# EAGLE design mainboard (EAGLE 5.11)
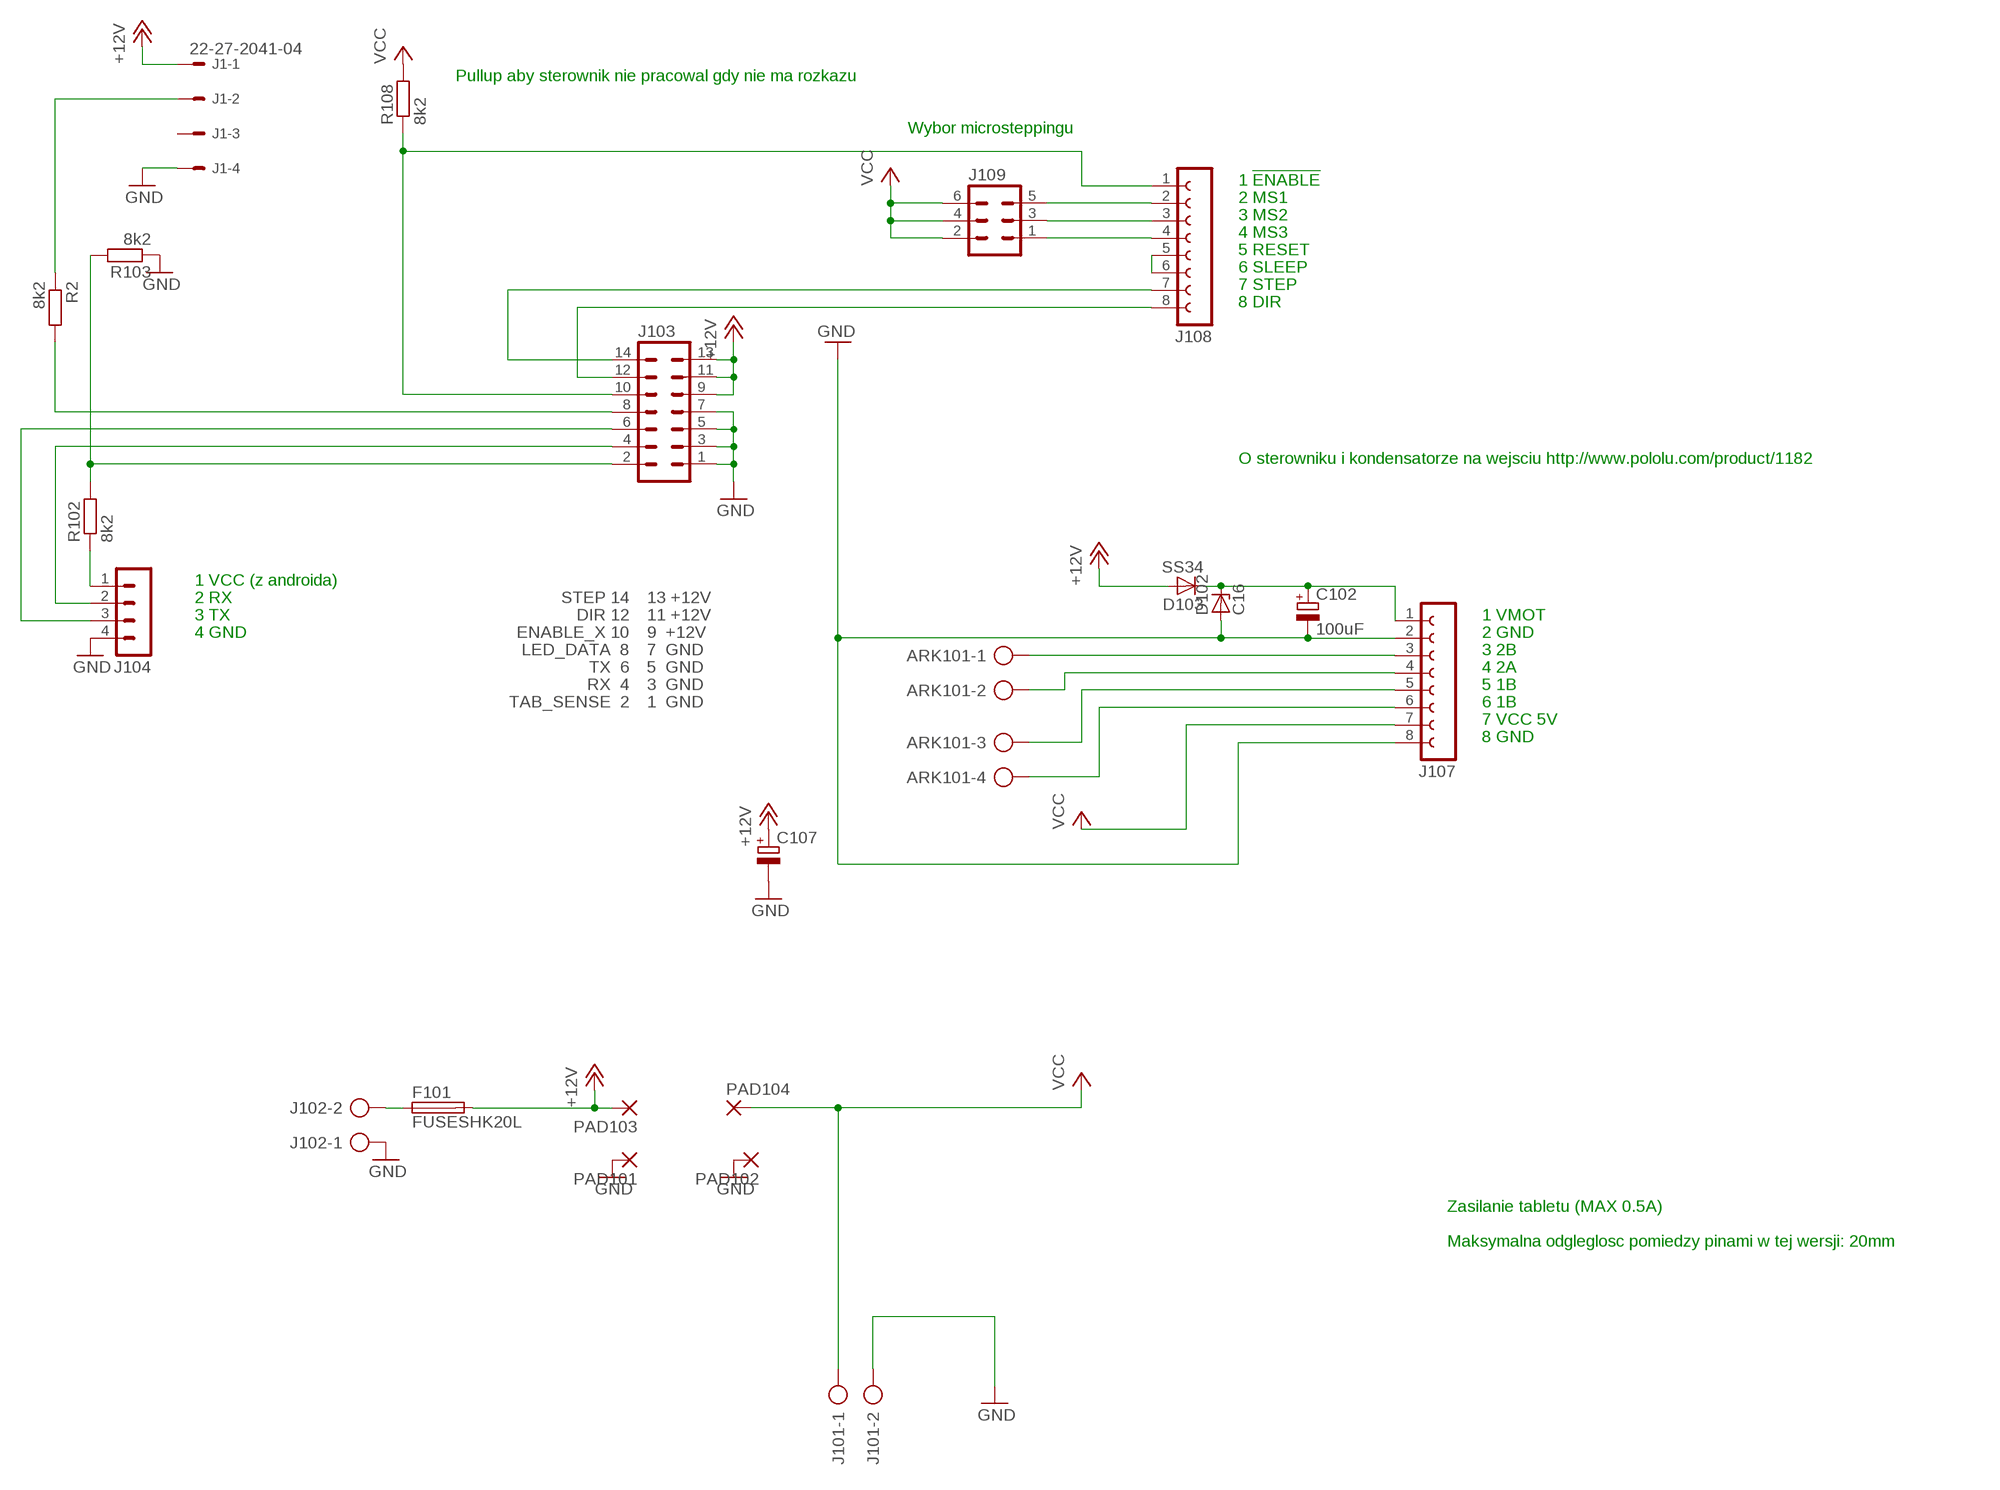
[diagram p0: schematic, sheet 1]

## Parts
ARK101  AK300/4  [AK300/4]
C102  100uF  CPOL-EUE5-10.5  [E5-10,5]
C107  CPOL-EUE5-8.5  [E5-8,5]
D102  C16  ZENER-DIODESOD80C  [SOD80C]
D103  SS34  BYS10  [SOD106A]
F101  FUSESHK20L  [SHK20L]
J1  22-27-2041-04  [6410-04]
J101  AK300/2  [AK300/2]
J102  AK300/2  [AK300/2]
J103  ML14  [ML14]
J104  MA04-1  [MA04-1]
J107  FE08-1  [FE08]
J108  FE08-1  [FE08]
J109  MA03-2  [MA03-2]
PAD101  3,17/1,1  [3,17/1,1]
PAD102  3,17/1,1  [3,17/1,1]
PAD103  3,17/1,1  [3,17/1,1]
PAD104  3,17/1,1  [3,17/1,1]
R2  8k2  RES0805  [0805]
R102  8k2  RES0805  [0805]
R103  8k2  RES0805  [0805]
R108  8k2  RES0805  [0805]

## Nets
+12V: C107.+ D103.A F101.2A J1.1 J103.9 J103.11 J103.13 PAD103.1(P)
CARRET_RESET: J103.2 R102.2 R103.2
GND: C102.- C107.- D102.A J1.4 J101.2 J102.1 J103.1 J103.3 J103.5 J103.7 J104.4 J107.2 J107.8 PAD101.1(P) PAD102.1(P) R103.1
JUMPER101: J103.10 J108.1 R108.1
MISO: J103.12 J108.8
N$3: J103.14 J108.7
N$4: J1.2 R2.1
N$7: J104.1 R102.1
N$16: F101.1A J102.2
N$17: ARK101.1 J107.3
N$18: ARK101.2 J107.4
N$19: ARK101.3 J107.5
N$20: ARK101.4 J107.6
N$24: J108.5 J108.6
N$35: J108.2 J109.5
N$39: J108.3 J109.3
N$40: J108.4 J109.1
N$43: C102.+ D102.C D103.K J107.1
SCK: J103.8 R2.2
SCL: J103.4 J104.2
SDA: J103.6 J104.3
VCC: J101.1 J107.7 J109.2 J109.4 J109.6 PAD104.1(P) R108.2
Unconnected: J1.3

## Notes on the sheet
- Pullup aby sterownik nie pracowal gdy nie ma rozkazu
- Wybor microsteppingu
- 1 !ENABLE
- 2 MS1
- 3 MS2
- 4 MS3
- 5 RESET
- 6 SLEEP
- 7 STEP
- 8 DIR
- O sterowniku i kondensatorze na wejsciu http://www.pololu.com/product/1182
- 1 VCC (z androida)
- 2 RX | STEP 14 | 13 +12V
- 3 TX | DIR 12 | 11 +12V | 1 VMOT
- 4 GND | ENABLE_X 10 | 9  +12V | 2 GND
- LED_DATA  8 | 7  GND | 3 2B
- TX  6 | 5  GND | 4 2A
- RX  4 | 3  GND | 5 1B
- TAB_SENSE  2 | 1  GND | 6 1B
- 7 VCC 5V
- 8 GND
- Zasilanie tabletu (MAX 0.5A)
- Maksymalna odgleglosc pomiedzy pinami w tej wersji: 20mm

## Library data of the parts
ARK101 = con-ptr500:AK300/4: CONNECTOR
C102 C107 = rcl:CPOL-EU: POLARIZED CAPACITOR, European symbol
D102 = diode:ZENER-DIODE: Z-Diode
D103 = telefunken:BYS10: DIODE
F101 = fuse:FUSE: Fuse
J1 = con-molex:22-?-04: CONNECTOR wire to board 2.54 mm (.1 inch) pitch header
J101 J102 = con-ptr500:AK300/2: CONNECTOR
J103 = con-ml:ML14: HARTING
J104 = con-lstb:MA04-1: PIN HEADER
J107 J108 = con-lsta:FE08-1: FEMALE HEADER
J109 = con-lstb:MA03-2: PIN HEADER
PAD101-PAD104 = wirepad:3,17/1,1: THROUGH-HOLE PAD
R2 R102 R103 R108 = barobot:RES

## Board
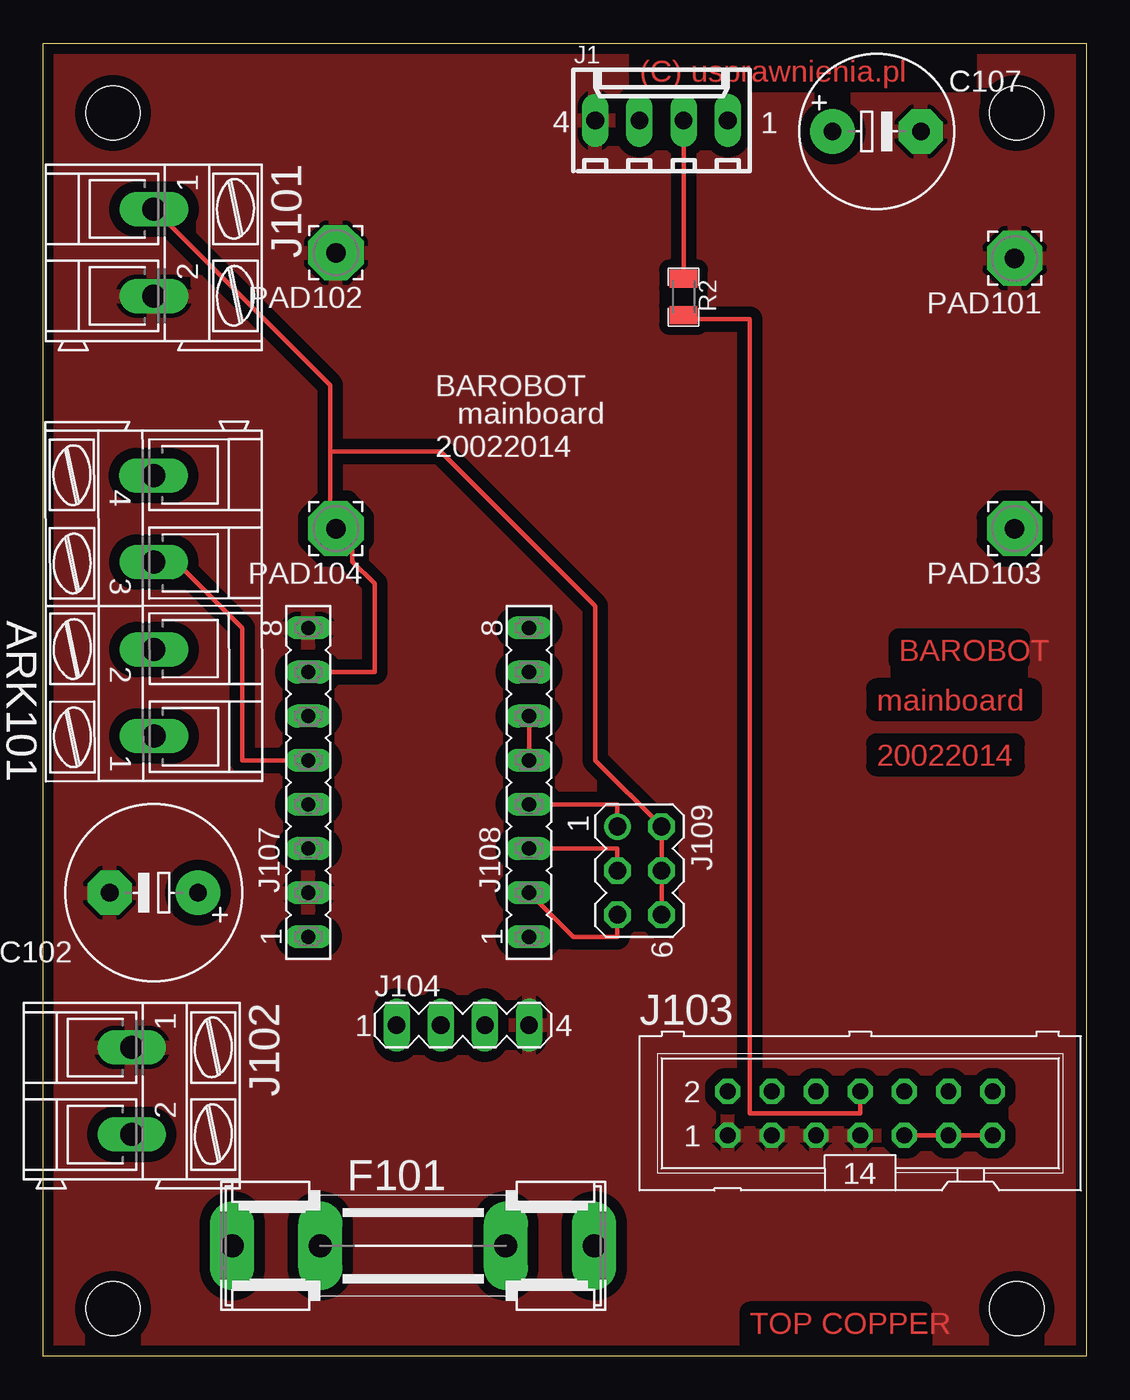
[diagram p1: board, top side]
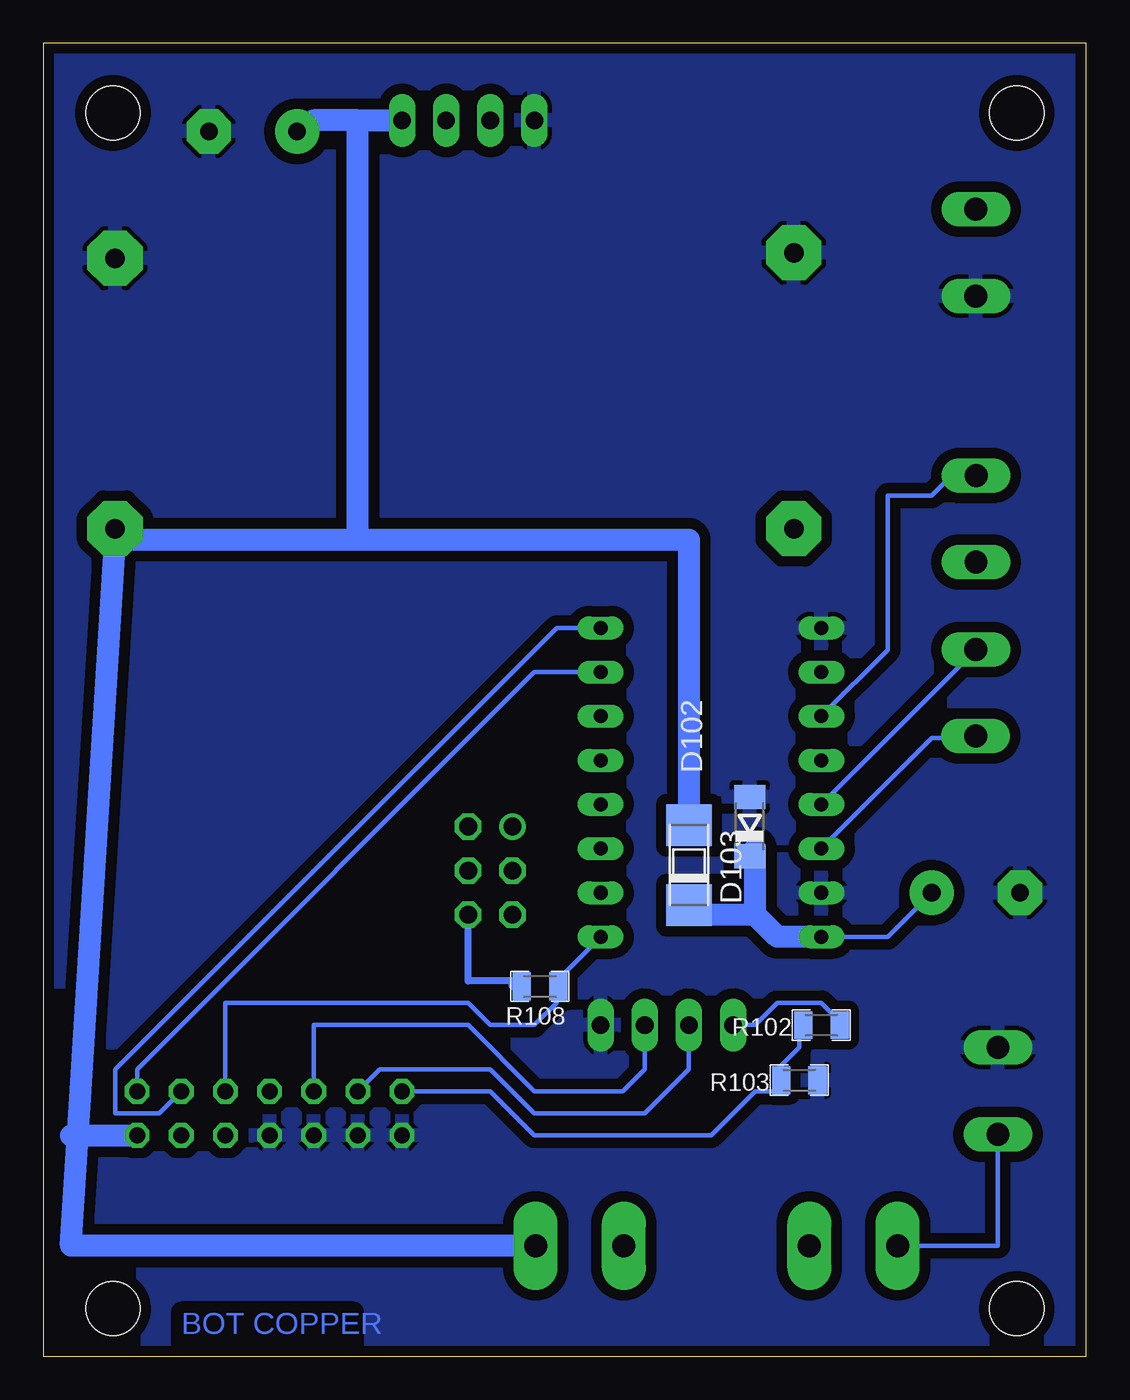
[diagram p2: board, bottom side, seen from below]

Size 60 x 75.55 mm. Coordinates in mm from the lower left corner, seen from the top.
Outline: 0,0 0,75.55 60,75.55 60,0 0,0
Copper layers (1*16): Top 0.035mm / dielectric 1.5mm / Bottom 0.035mm
Design rules "default *": minimum track width 10mil, minimum drill 0.5mm, track to track 8mil, track to pad 8mil, pad to pad 8mil, via to via 8mil, smd to smd 8mil, copper to edge 20mil, drill to drill 8mil, minimum pad ring 10mil, minimum via ring 8mil, stop-mask expansion 4mil, vias tented up to drill 0mil, thermal gap 10mil
Holes 3.1 mm at 4,2.73 56,2.73 56,71.55 4,71.55

### Footprints (pad centres in the part's own frame; a part is rotated, then mirrored left to right if it is on the bottom)
AK300/4 = drill 1.321 long: 1 -7.493,0; 2 -2.515,0; 3 2.515,0; 4 7.493,0
E5-10,5 = drill 1.016 pad 2.54 round: + -2.54,0 | drill 1.016 pad 2.54 octagon: - 2.54,0
E5-8,5 = drill 1.016 pad 2.54 round: + -2.54,0 | drill 1.016 pad 2.54 octagon: - 2.54,0
SOD80C = smd 1.4 x 1.8: A 1.7,0; C -1.7,0
SOD106A = smd 2.4 x 2.6: A 2.3,0; K -2.3,0
SHK20L = drill 1.321 pad 2.54 long: 1A -10.414,0; 1B -5.334,0; 2A 10.414,0; 2B 5.334,0
6410-04 = drill 1.016 long: 1 3.81,0; 2 1.27,0; 3 -1.27,0; 4 -3.81,0
AK300/2 = drill 1.321 long: 1 -2.515,0; 2 2.489,0
ML14 = drill 0.914 octagon: 1 -7.62,-1.27; 2 -7.62,1.27; 3 -5.08,-1.27; 4 -5.08,1.27; 5 -2.54,-1.27; 6 -2.54,1.27; 7 0,-1.27; 8 0,1.27; 9 2.54,-1.27; 10 2.54,1.27; 11 5.08,-1.27; 12 5.08,1.27; 13 7.62,-1.27; 14 7.62,1.27
MA04-1 = drill 1.016 long: 1 -3.81,0; 2 -1.27,0; 3 1.27,0; 4 3.81,0
FE08 = drill 0.813 long: 1 -8.89,0; 2 -6.35,0; 3 -3.81,0; 4 -1.27,0; 5 1.27,0; 6 3.81,0; 7 6.35,0; 8 8.89,0
MA03-2 = drill 1.016 round: 1 -2.54,-1.27 | drill 1.016 octagon: 2 -2.54,1.27; 3 0,-1.27; 4 0,1.27; 5 2.54,-1.27; 6 2.54,1.27
3,17/1,1 = drill 1.118 pad 3.175 octagon: 1 0,0
0805 = smd 1.044 x 1.6: 1 -1.048,0; 2 1.048,0

### Placement (x,y rotation side)
ARK101  6.35,43.18 90.1 top
C102  6.35,26.67 180 top
C107  47.94,70.48 0 top
D102  19.37,30.48 90 bottom
D103  22.86,28.26 90 bottom
F101  21.27,6.35 0 top
J1  35.56,71.12 0 top
J101  6.35,63.5 270 top
J102  5.08,15.24 270 top
J103  46.99,13.97 0 top
J104  24.13,19.05 0 top
J107  15.24,33.02 90 top
J108  27.94,33.02 90 top
J109  34.29,27.94 270 top
PAD101  55.88,63.18 180 top
PAD102  16.83,63.5 180 top
PAD103  55.88,47.62 180 top
PAD104  16.83,47.62 180 top
R2  36.83,60.96 270 top
R102  15.24,19.05 180 bottom
R103  16.51,15.88 180 bottom
R108  31.43,21.27 180 bottom

### Tracks (layer width: path | path; a pad name or v marks a point on that pad's centre or on a via)
+12V
  Top 0.254: J103.9 J103.11 J103.13
  Bottom 0.254: 55.88,46.99 PAD103.1 | 57.95,13.94 58.42,12.7
  Bottom 1.27: 41.91,71.12 J1.1 | 41.91,71.12 44.45,71.12 C107.+ | F101.2A 58.42,6.35 57.95,13.94 55.88,46.99 41.91,46.99 | 41.91,46.99 22.86,46.99 D103.A | 41.91,46.99 41.91,71.12 | 58.42,12.7 J103.13
CARRET_RESET
  Bottom 0.254: R102.2 16.51,19.05 16.51,17.78 17.78,16.51 R103.2 17.78,15.24 19.05,15.24 21.59,12.7 31.75,12.7 34.29,15.24 J103.2
GND
  pour Top (isolate 0.61): 0,74.93 59.69,74.93 59.69,0 0,0
  pour Bottom (isolate 0.61): 0,76.2 59.69,76.2 59.69,0 0,0
JUMPER101
  Bottom 0.254: 30.48,21.59 J108.1 | J103.10 49.53,20.32 35.56,20.32 34.29,19.05 31.75,19.05 30.48,20.32 30.48,21.59 | R108.1 30.48,21.59
MISO
  Bottom 0.254: J108.8 30.48,41.91 55.88,16.51 55.88,13.97 53.34,13.97 J103.12
N$3
  Bottom 0.254: J108.7 31.75,39.37 54.61,16.51 J103.14
N$4
  Top 0.254: R2.1 J1.2
N$7
  Bottom 0.254: J104.1 19.05,19.05 17.78,20.32 15.24,20.32 13.97,19.05 R102.1
N$16
  Bottom 0.254: J102.2 5.08,6.35 F101.1A
N$17
  Bottom 0.254: J107.3 8.89,35.56 7.62,35.56 ARK101.1
N$18
  Bottom 0.254: J107.4 6.35,40.64 ARK101.2
N$19
  Top 0.254: J107.5 11.43,34.29 11.43,41.91 7.62,45.72 6.35,45.72 ARK101.3
N$20
  Bottom 0.254: J107.6 11.43,40.64 11.43,49.53 8.89,49.53 7.62,50.8 6.35,50.8 ARK101.4
N$24
  Top 0.254: J108.5 J108.6
N$35
  Top 0.254: J108.2 30.48,24.13 33.02,24.13 J109.5
N$39
  Top 0.254: J108.3 33.02,29.21 J109.3
N$40
  Top 0.254: J108.4 33.02,31.75 J109.1
N$43
  Bottom 0.254: 19.05,29.21 D102.C | 22.86,25.4 D103.K | C102.+ 11.43,24.13 J107.1
  Bottom 1.27: 19.05,25.4 19.05,29.21 | 19.05,25.4 22.86,25.4 | 19.05,25.4 17.78,24.13 J107.1
SCK
  Top 0.254: J103.8 46.99,13.97 40.64,13.97 40.64,59.69 36.83,59.69 R2.2
SCL
  Bottom 0.254: J103.4 40.64,16.51 34.29,16.51 31.75,13.97 25.4,13.97 22.86,16.51 J104.2
SDA
  Bottom 0.254: J103.6 44.45,19.05 35.56,19.05 31.75,15.24 26.67,15.24 25.4,16.51 J104.3
VCC
  Top 0.254: J109.6 J109.4 J109.2 31.75,34.29 31.75,43.18 22.86,52.07 16.51,52.07 | J107.7 19.05,39.37 19.05,44.45 17.78,45.72 17.78,46.99 PAD104.1 16.51,48.26 16.51,52.07 | 16.51,52.07 16.51,55.88 6.35,66.04 J101.1
  Bottom 0.406: R108.2 33.02,21.27 33.02,21.59 35.56,21.59 J109.6

### Text on the board
Top: (C) usprawnienia.pl | BAROBOT | mainboard | 20022014 | TOP COPPER
Bottom: BOT COPPER
tPlace: BAROBOT | mainboard | 20022014